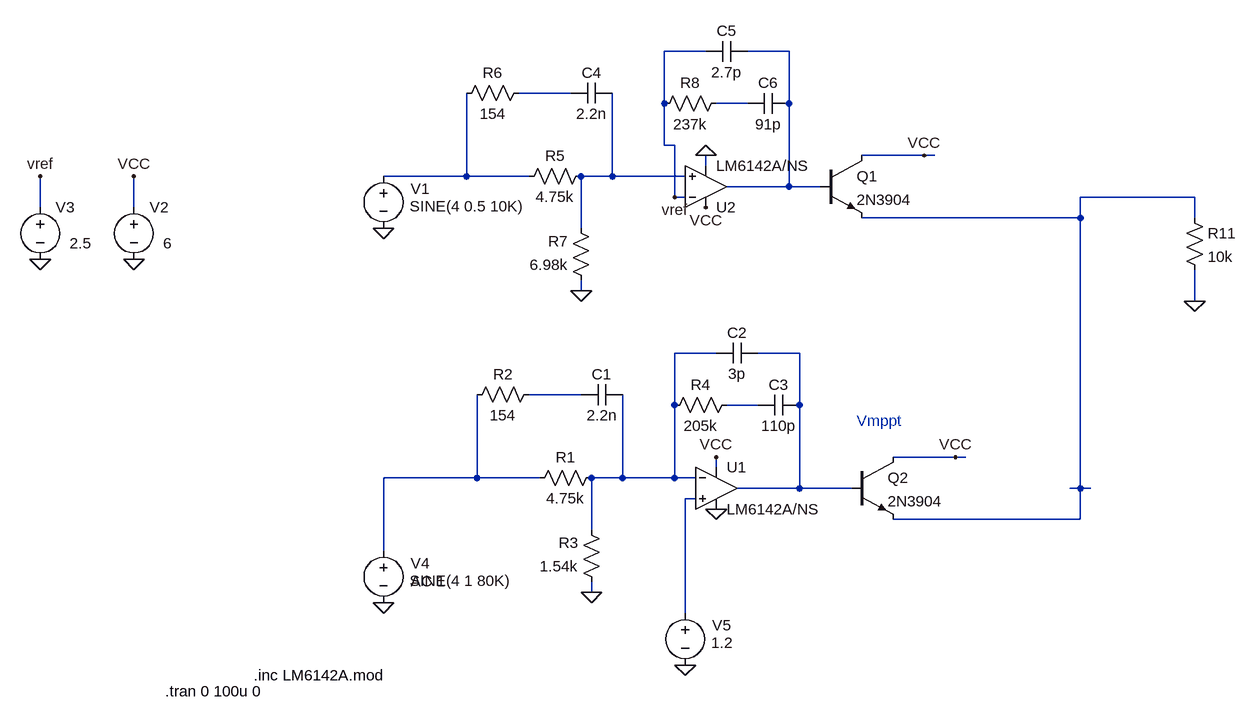
[diagram p0: schematic Compensated-Error-Amplifiers2.asc]
Compensated-Error-Amplifiers2.asc, the LTspice schematic file:
Version 4
SHEET 1 1320 680
WIRE 496 -560 432 -560
WIRE 624 -560 560 -560
WIRE 288 -496 208 -496
WIRE 432 -480 432 -560
WIRE 560 -480 512 -480
WIRE 624 -480 624 -560
WIRE 432 -416 432 -480
WIRE 448 -416 432 -416
WIRE 832 -400 736 -400
WIRE 848 -400 832 -400
WIRE 496 -384 496 -400
WIRE 128 -368 128 -496
WIRE 128 -368 0 -368
WIRE 224 -368 128 -368
WIRE 352 -368 352 -496
WIRE 352 -368 304 -368
WIRE 464 -368 352 -368
WIRE 624 -352 624 -480
WIRE 624 -352 528 -352
WIRE 672 -352 624 -352
WIRE 448 -336 448 -416
WIRE 464 -336 448 -336
WIRE 1248 -336 1072 -336
WIRE -528 -320 -528 -368
WIRE -384 -320 -384 -368
WIRE 1072 -304 1072 -336
WIRE 1072 -304 736 -304
WIRE 1248 -304 1248 -336
WIRE 304 -288 304 -368
WIRE 304 -192 304 -208
WIRE 1248 -176 1248 -224
WIRE 512 -96 448 -96
WIRE 640 -96 576 -96
WIRE 304 -32 224 -32
WIRE 448 -16 448 -96
WIRE 576 -16 528 -16
WIRE 640 -16 640 -96
WIRE 880 64 784 64
WIRE 896 64 880 64
WIRE 512 80 512 64
WIRE 144 96 144 -32
WIRE 144 96 0 96
WIRE 240 96 144 96
WIRE 368 96 368 -32
WIRE 368 96 320 96
WIRE 448 96 448 -16
WIRE 448 96 368 96
WIRE 480 96 448 96
WIRE 640 112 640 -16
WIRE 640 112 544 112
WIRE 720 112 640 112
WIRE 1072 112 1072 -304
WIRE 1072 112 1056 112
WIRE 1088 112 1072 112
WIRE 480 128 464 128
WIRE 1072 160 1072 112
WIRE 1072 160 784 160
WIRE 320 176 320 96
WIRE 0 208 0 96
WIRE 320 272 320 256
WIRE 464 304 464 128
FLAG 0 -288 0
FLAG 320 272 0
FLAG 512 144 0
FLAG -384 -240 0
FLAG -384 -368 VCC
FLAG 512 64 VCC
FLAG -528 -240 0
FLAG -528 -368 vref
FLAG 304 -192 0
FLAG 496 -400 0
FLAG 496 -320 VCC
FLAG 0 288 0
FLAG 1248 -176 0
FLAG 448 -336 vref
FLAG 464 384 0
FLAG 832 -400 VCC
FLAG 880 64 VCC
SYMBOL voltage 0 -384 R0
WINDOW 3 40 62 Left 2
WINDOW 123 24 124 Left 2
WINDOW 39 0 0 Left 2
WINDOW 0 42 35 Left 2
SYMATTR Value SINE(4 0.5 10K)
SYMATTR InstName V1
SYMBOL res 336 80 R90
WINDOW 0 0 56 VBottom 2
WINDOW 3 32 56 VTop 2
SYMATTR InstName R1
SYMATTR Value 4.75k
SYMBOL res 240 -48 R90
WINDOW 0 0 56 VBottom 2
WINDOW 3 32 56 VTop 2
SYMATTR InstName R2
SYMATTR Value 154
SYMBOL res 336 272 R180
WINDOW 0 36 76 Left 2
WINDOW 3 36 40 Left 2
SYMATTR InstName R3
SYMATTR Value 1.54k
SYMBOL Opamps\\opamp2 512 48 R0
SYMATTR InstName U1
SYMATTR Value LM6142A/NS
SYMBOL res 544 -32 R90
WINDOW 0 0 56 VBottom 2
WINDOW 3 32 56 VTop 2
SYMATTR InstName R4
SYMATTR Value 205k
SYMBOL cap 368 -48 R90
WINDOW 0 0 32 VBottom 2
WINDOW 3 32 32 VTop 2
SYMATTR InstName C1
SYMATTR Value 2.2n
SYMBOL cap 576 -112 R90
WINDOW 0 0 32 VBottom 2
WINDOW 3 32 32 VTop 2
SYMATTR InstName C2
SYMATTR Value 3p
SYMBOL cap 640 -32 R90
WINDOW 0 0 32 VBottom 2
WINDOW 3 32 32 VTop 2
SYMATTR InstName C3
SYMATTR Value 110p
SYMBOL voltage -384 -336 R0
WINDOW 3 45 71 Left 2
WINDOW 123 24 124 Left 2
WINDOW 39 0 0 Left 2
SYMATTR Value 6
SYMATTR InstName V2
SYMBOL voltage -528 -336 R0
WINDOW 3 45 71 Left 2
WINDOW 123 24 124 Left 2
WINDOW 39 0 0 Left 2
SYMATTR Value 2.5
SYMATTR InstName V3
SYMBOL res 320 -384 R90
WINDOW 0 0 56 VBottom 2
WINDOW 3 32 56 VTop 2
SYMATTR InstName R5
SYMATTR Value 4.75k
SYMBOL res 224 -512 R90
WINDOW 0 0 56 VBottom 2
WINDOW 3 32 56 VTop 2
SYMATTR InstName R6
SYMATTR Value 154
SYMBOL res 320 -192 R180
WINDOW 0 36 76 Left 2
WINDOW 3 36 40 Left 2
SYMATTR InstName R7
SYMATTR Value 6.98k
SYMBOL Opamps\\opamp2 496 -288 M180
SYMATTR InstName U2
SYMATTR Value LM6142A/NS
SYMBOL res 528 -496 R90
WINDOW 0 0 56 VBottom 2
WINDOW 3 32 56 VTop 2
SYMATTR InstName R8
SYMATTR Value 237k
SYMBOL cap 352 -512 R90
WINDOW 0 0 32 VBottom 2
WINDOW 3 32 32 VTop 2
SYMATTR InstName C4
SYMATTR Value 2.2n
SYMBOL cap 560 -576 R90
WINDOW 0 0 32 VBottom 2
WINDOW 3 32 32 VTop 2
SYMATTR InstName C5
SYMATTR Value 2.7p
SYMBOL cap 624 -496 R90
WINDOW 0 0 32 VBottom 2
WINDOW 3 32 32 VTop 2
SYMATTR InstName C6
SYMATTR Value 91p
SYMBOL voltage 0 192 R0
WINDOW 3 40 62 Left 2
WINDOW 123 42 63 Left 2
WINDOW 39 0 0 Left 2
WINDOW 0 42 35 Left 2
SYMATTR Value SINE(4 1 80K)
SYMATTR Value2 AC 1
SYMATTR InstName V4
SYMBOL res 1232 -320 R0
SYMATTR InstName R11
SYMATTR Value 10k
SYMBOL voltage 464 288 R0
WINDOW 3 40 62 Left 2
WINDOW 123 24 124 Left 2
WINDOW 39 0 0 Left 2
WINDOW 0 42 35 Left 2
SYMATTR Value 1.2
SYMATTR InstName V5
SYMBOL npn 672 -400 R0
SYMATTR InstName Q1
SYMATTR Value 2N3904
SYMBOL npn 720 64 R0
SYMATTR InstName Q2
SYMATTR Value 2N3904
TEXT -200 400 Left 2 !.inc LM6142A.mod
TEXT -336 424 Left 2 !.tran 0 100u 0
TEXT 728 8 Left 2 ;Vmppt

The netlist it stands for:
* Compensated-Error-Amplifiers2.asc
V1 N004 0 SINE(4 0.5 10K)
R1 N007 N011 4.75k
R2 N009 N011 154
R3 0 N007 1.54k
XU1 N012 N007 VCC 0 N008 LM6142A/NS  ; pins In+ In- V+ V- OUT
R4 N010 N007 205k
C1 N007 N009 2.2n
C2 N008 N007 3p
C3 N008 N010 110p
V2 VCC 0 6
V3 vref 0 2.5
R5 N005 N004 4.75k
R6 N002 N004 154
R7 0 N005 6.98k
XU2 N005 vref VCC 0 N001 LM6142A/NS  ; pins In+ In- V+ V- OUT
R8 N003 vref 237k
C4 N005 N002 2.2n
C5 N001 vref 2.7p
C6 N001 N003 91p
V4 N011 0 SINE(4 1 80K) AC 1
R11 N006 0 10k
V5 N012 0 1.2
Q1 VCC N001 N006 0 2N3904
Q2 VCC N008 N006 0 2N3904
.model NPN NPN
.model PNP PNP
.lib standard.bjt
.inc LM6142A.mod
.tran 0 100u 0
* Vmppt
.backanno
.end